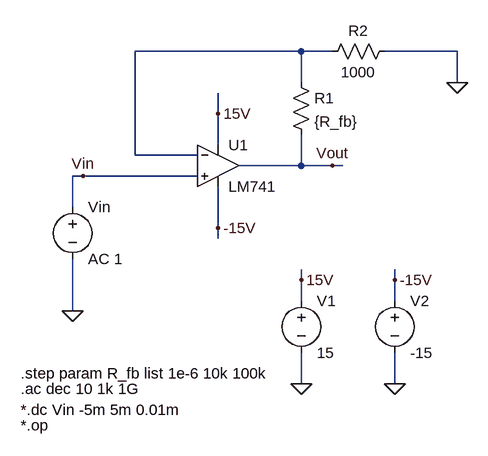
[diagram p0: schematic Non-Inverting-AC.asc]
Non-Inverting-AC.asc, the LTspice schematic file:
Version 4
SHEET 1 880 680
WIRE 512 80 256 80
WIRE 560 80 512 80
WIRE 752 80 640 80
WIRE 512 128 512 80
WIRE 752 128 752 80
WIRE 384 176 384 144
WIRE 384 224 384 176
WIRE 256 240 256 80
WIRE 352 240 256 240
WIRE 512 256 512 208
WIRE 512 256 416 256
WIRE 560 256 512 256
WIRE 576 256 560 256
WIRE 176 272 160 272
WIRE 352 272 176 272
WIRE 160 320 160 272
WIRE 384 352 384 288
WIRE 384 368 384 352
WIRE 512 432 512 416
WIRE 656 432 656 416
WIRE 512 464 512 432
WIRE 656 464 656 432
WIRE 160 480 160 400
WIRE 512 592 512 544
WIRE 656 592 656 544
FLAG 384 176 15V
FLAG 384 352 -15V
FLAG 752 128 0
FLAG 176 272 Vin
FLAG 560 256 Vout
FLAG 656 592 0
FLAG 512 592 0
FLAG 512 432 15V
FLAG 656 432 -15V
FLAG 160 480 0
SYMBOL LM741 384 192 R0
SYMATTR InstName U1
SYMBOL Res 496 112 R0
SYMATTR InstName R1
SYMATTR Value {R_fb}
SYMBOL Res 656 64 R90
WINDOW 0 0 56 VBottom 2
WINDOW 3 32 56 VTop 2
SYMATTR InstName R2
SYMATTR Value 1000
SYMBOL Voltage 160 304 R0
SYMATTR InstName Vin
SYMATTR Value AC 1
SYMBOL Voltage 512 448 R0
SYMATTR InstName V1
SYMATTR Value 15
SYMBOL Voltage 656 448 R0
SYMATTR InstName V2
SYMATTR Value -15
TEXT 80 576 Left 2 !.step param R_fb list 1e-6 10k 100k
TEXT 80 600 Left 2 !.ac dec 10 1k 1G
TEXT 80 632 Left 2 !*.dc Vin -5m 5m 0.01m
TEXT 80 656 Left 2 !*.op

The netlist it stands for:
* Non-Inverting-AC.asc
XU1 Vin N001 15V -15V Vout LM741  ; pins In+ In- V+ V- OUT
R1 N001 Vout {R_fb}
R2 0 N001 1000
Vin Vin 0 AC 1
V1 15V 0 15
V2 -15V 0 -15
.step param R_fb list 1e-6 10k 100k
.ac dec 10 1k 1G
*.dc Vin -5m 5m 0.01m
*.op
.lib LM741.lib
.backanno
.end